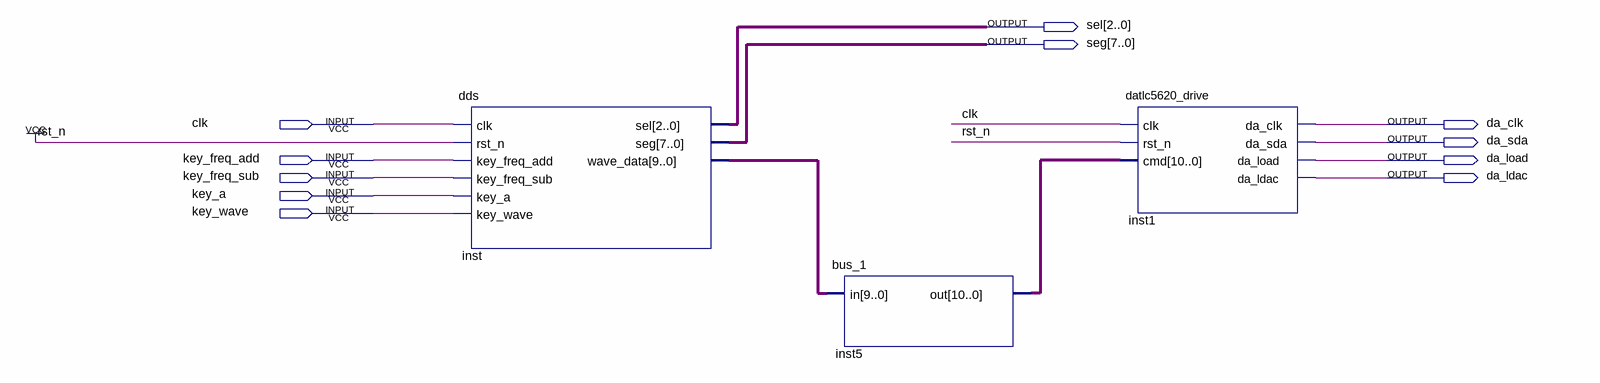
[diagram p0: schematic sheet]
// Quartus schematic top.bdf as structural Verilog: 3 symbols, 11 pins
module top (
  input  clk,
  input  key_freq_add,
  input  key_freq_sub,
  input  key_a,
  input  key_wave,
  output [2:0] sel,
  output [7:0] seg,
  output da_clk,
  output da_sda,
  output da_load,
  output da_ldac
);

  wire [9:0] inst_wave_data;
  wire [10:0] inst5_out;

  dds inst (
    .clk(clk), .rst_n(1'b1), .key_freq_add(key_freq_add), .key_freq_sub(key_freq_sub), .key_a(key_a),
    .key_wave(key_wave), .sel(sel), .seg(seg), .wave_data(inst_wave_data));
  bus_1 inst5 (.in(inst_wave_data), .out(inst5_out));
  datlc5620_drive inst1 (
    .clk(clk), .rst_n(1'b1), .cmd(inst5_out), .da_clk(da_clk), .da_sda(da_sda), .da_load(da_load),
    .da_ldac(da_ldac));
endmodule
